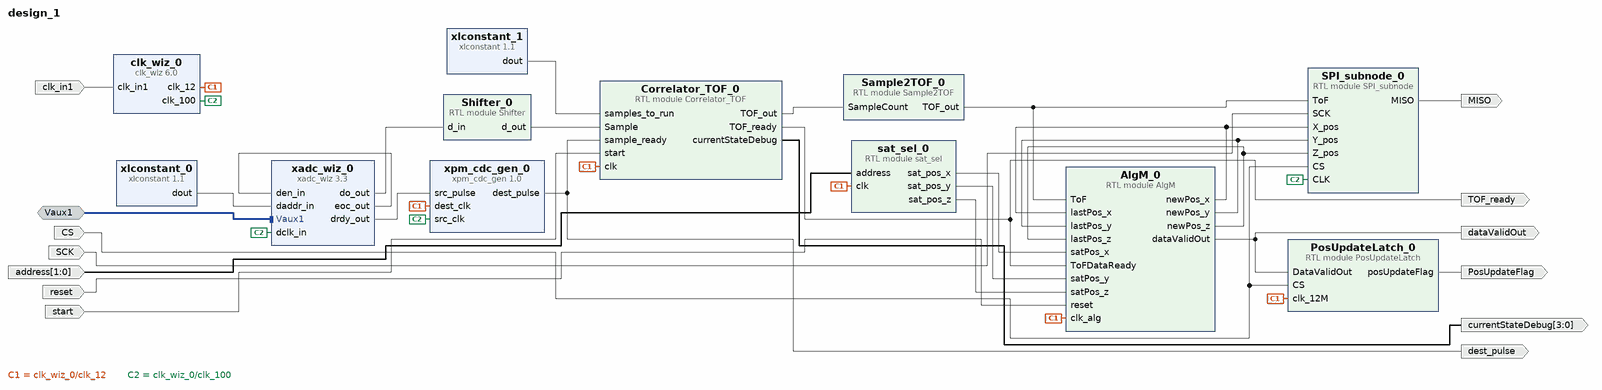
[diagram p0: block diagram of the top level]
# Vivado block design design_1, xc7a200tsbg484-1, Vivado 2024.1.2
create_bd_design design_1

create_bd_intf_port -mode Slave -vlnv xilinx.com:interface:diff_analog_io_rtl:1.0 Vaux1
create_bd_port -dir I -type clk clk_in1
set_property -dict {CONFIG.FREQ_HZ 100000000} [get_bd_ports clk_in1]
create_bd_port -dir I start
create_bd_port -dir O TOF_ready
create_bd_port -dir O dataValidOut
create_bd_port -dir I -from 1 -to 0 address
create_bd_port -dir I -type rst reset
create_bd_port -dir I CS
create_bd_port -dir I SCK
create_bd_port -dir O MISO
create_bd_port -dir O dest_pulse
create_bd_port -dir O PosUpdateFlag
create_bd_port -dir O -from 3 -to 0 currentStateDebug

create_bd_cell -type ip -vlnv xilinx.com:ip:xadc_wiz:3.3 xadc_wiz_0
set_property -dict [list \
  CONFIG.ADC_CONVERSION_RATE 500 \
  CONFIG.ENABLE_RESET false \
  CONFIG.EXTERNAL_MUX_CHANNEL VP_VN \
  CONFIG.INTERFACE_SELECTION ENABLE_DRP \
  CONFIG.OT_ALARM false \
  CONFIG.SEQUENCER_MODE Off \
  CONFIG.SIM_FILE_NAME sample \
  CONFIG.SINGLE_CHANNEL_SELECTION VAUXP1_VAUXN1 \
  CONFIG.USER_TEMP_ALARM false \
  CONFIG.VCCAUX_ALARM false \
  CONFIG.VCCINT_ALARM false \
  CONFIG.XADC_STARUP_SELECTION single_channel \
] [get_bd_cells xadc_wiz_0]
create_bd_cell -type ip -vlnv xilinx.com:ip:xlconstant:1.1 xlconstant_0
set_property -dict {CONFIG.CONST_VAL 17 CONFIG.CONST_WIDTH 7} [get_bd_cells xlconstant_0]
create_bd_cell -type module -reference Shifter Shifter_0
create_bd_cell -type ip -vlnv xilinx.com:ip:clk_wiz:6.0 clk_wiz_0
set_property -dict [list \
  CONFIG.CLKOUT1_JITTER 137.681 \
  CONFIG.CLKOUT1_PHASE_ERROR 105.461 \
  CONFIG.CLKOUT2_JITTER 211.763 \
  CONFIG.CLKOUT2_PHASE_ERROR 105.461 \
  CONFIG.CLKOUT2_REQUESTED_OUT_FREQ 12 \
  CONFIG.CLKOUT2_USED true \
  CONFIG.CLK_IN1_BOARD_INTERFACE sys_clock \
  CONFIG.CLK_OUT1_PORT clk_100 \
  CONFIG.CLK_OUT2_PORT clk_12 \
  CONFIG.MMCM_CLKFBOUT_MULT_F 9.000 \
  CONFIG.MMCM_CLKOUT0_DIVIDE_F 9.000 \
  CONFIG.MMCM_CLKOUT1_DIVIDE 75 \
  CONFIG.NUM_OUT_CLKS 2 \
  CONFIG.USE_LOCKED false \
  CONFIG.USE_RESET false \
] [get_bd_cells clk_wiz_0]
create_bd_cell -type ip -vlnv xilinx.com:ip:xpm_cdc_gen:1.0 xpm_cdc_gen_0
set_property -dict {CONFIG.CDC_TYPE xpm_cdc_pulse CONFIG.INIT_SYNC_FF true CONFIG.RST_USED false} [get_bd_cells xpm_cdc_gen_0]
create_bd_cell -type module -reference Correlator_TOF Correlator_TOF_0
create_bd_cell -type ip -vlnv xilinx.com:ip:xlconstant:1.1 xlconstant_1
set_property -dict {CONFIG.CONST_VAL 15000 CONFIG.CONST_WIDTH 16} [get_bd_cells xlconstant_1]
create_bd_cell -type module -reference AlgM AlgM_0
create_bd_cell -type module -reference sat_sel sat_sel_0
create_bd_cell -type module -reference SPI_subnode SPI_subnode_0
create_bd_cell -type module -reference Sample2TOF Sample2TOF_0
create_bd_cell -type module -reference PosUpdateLatch PosUpdateLatch_0

# ---- connections ----

connect_bd_intf_net -intf_net Vaux1_1 [get_bd_intf_pins xadc_wiz_0/Vaux1] [get_bd_intf_ports Vaux1]
connect_bd_net [get_bd_pins AlgM_0/dataValidOut] [get_bd_ports dataValidOut] [get_bd_pins PosUpdateLatch_0/DataValidOut]
connect_bd_net [get_bd_pins AlgM_0/newPos_x] [get_bd_pins SPI_subnode_0/X_pos] [get_bd_pins AlgM_0/lastPos_x]
connect_bd_net [get_bd_pins AlgM_0/newPos_y] [get_bd_pins SPI_subnode_0/Y_pos] [get_bd_pins AlgM_0/lastPos_y]
connect_bd_net [get_bd_pins AlgM_0/newPos_z] [get_bd_pins SPI_subnode_0/Z_pos] [get_bd_pins AlgM_0/lastPos_z]
connect_bd_net [get_bd_ports CS] [get_bd_pins PosUpdateLatch_0/CS] [get_bd_pins SPI_subnode_0/CS]
connect_bd_net [get_bd_pins Correlator_TOF_0/TOF_out] [get_bd_pins Sample2TOF_0/SampleCount]
connect_bd_net [get_bd_pins Correlator_TOF_0/TOF_ready] [get_bd_ports TOF_ready] [get_bd_pins AlgM_0/ToFDataReady]
connect_bd_net [get_bd_pins Correlator_TOF_0/currentStateDebug] [get_bd_ports currentStateDebug]
connect_bd_net [get_bd_pins PosUpdateLatch_0/posUpdateFlag] [get_bd_ports PosUpdateFlag]
connect_bd_net [get_bd_ports SCK] [get_bd_pins SPI_subnode_0/SCK]
connect_bd_net [get_bd_pins SPI_subnode_0/MISO] [get_bd_ports MISO]
connect_bd_net [get_bd_pins Sample2TOF_0/TOF_out] [get_bd_pins SPI_subnode_0/ToF] [get_bd_pins AlgM_0/ToF]
connect_bd_net [get_bd_pins Shifter_0/d_out] [get_bd_pins Correlator_TOF_0/Sample]
connect_bd_net [get_bd_ports address] [get_bd_pins sat_sel_0/address]
connect_bd_net -net clk_in1_1 [get_bd_ports clk_in1] [get_bd_pins clk_wiz_0/clk_in1]
connect_bd_net [get_bd_pins clk_wiz_0/clk_12] \
  [get_bd_pins PosUpdateLatch_0/clk_12M] [get_bd_pins xpm_cdc_gen_0/dest_clk] [get_bd_pins Correlator_TOF_0/clk] \
  [get_bd_pins sat_sel_0/clk] [get_bd_pins AlgM_0/clk_alg]
connect_bd_net [get_bd_pins clk_wiz_0/clk_100] [get_bd_pins xpm_cdc_gen_0/src_clk] [get_bd_pins xadc_wiz_0/dclk_in] [get_bd_pins SPI_subnode_0/CLK]
connect_bd_net [get_bd_ports reset] [get_bd_pins AlgM_0/reset]
connect_bd_net [get_bd_pins sat_sel_0/sat_pos_x] [get_bd_pins AlgM_0/satPos_x]
connect_bd_net [get_bd_pins sat_sel_0/sat_pos_y] [get_bd_pins AlgM_0/satPos_y]
connect_bd_net [get_bd_pins sat_sel_0/sat_pos_z] [get_bd_pins AlgM_0/satPos_z]
connect_bd_net [get_bd_ports start] [get_bd_pins Correlator_TOF_0/start]
connect_bd_net [get_bd_pins xadc_wiz_0/do_out] [get_bd_pins Shifter_0/d_in]
connect_bd_net [get_bd_pins xadc_wiz_0/drdy_out] [get_bd_pins xpm_cdc_gen_0/src_pulse]
connect_bd_net [get_bd_pins xadc_wiz_0/eoc_out] [get_bd_pins xadc_wiz_0/den_in]
connect_bd_net [get_bd_pins xlconstant_0/dout] [get_bd_pins xadc_wiz_0/daddr_in]
connect_bd_net [get_bd_pins xlconstant_1/dout] [get_bd_pins Correlator_TOF_0/samples_to_run]
connect_bd_net [get_bd_pins xpm_cdc_gen_0/dest_pulse] [get_bd_ports dest_pulse] [get_bd_pins Correlator_TOF_0/sample_ready]

validate_bd_design
save_bd_design
